# EAGLE schematic control panel (EAGLE 8.4.3)
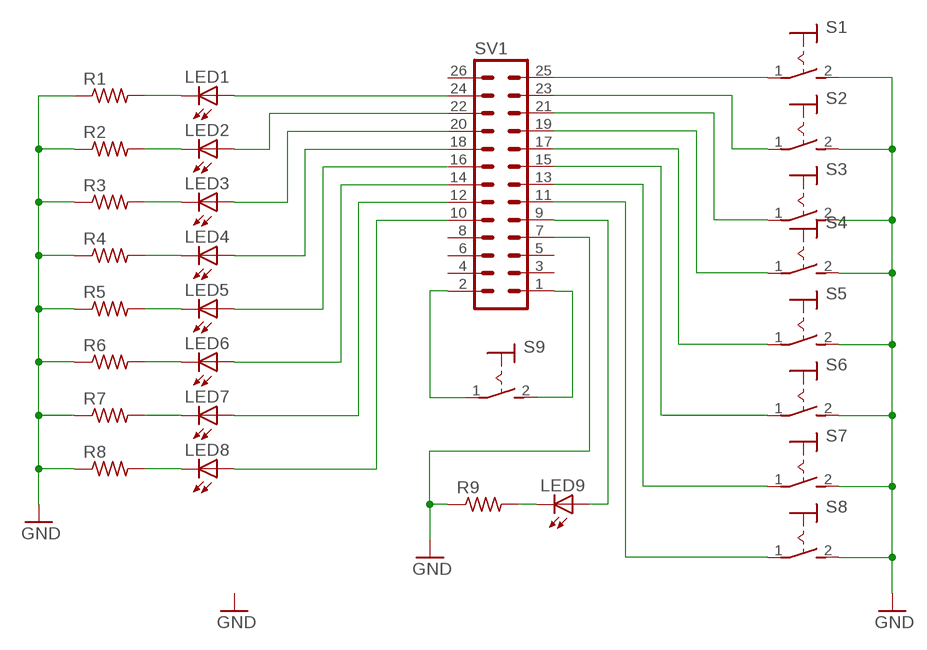
[diagram p0: schematic, sheet 1]

## Parts
LED1  LED3MM  [LED3MM]
LED2  LED3MM  [LED3MM]
LED3  LED3MM  [LED3MM]
LED4  LED3MM  [LED3MM]
LED5  LED3MM  [LED3MM]
LED6  LED3MM  [LED3MM]
LED7  LED3MM  [LED3MM]
LED8  LED3MM  [LED3MM]
LED9  LED3MM  [LED3MM]
R1  R-US_0309/12  [0309/12]
R2  R-US_0309/12  [0309/12]
R3  R-US_0309/12  [0309/12]
R4  R-US_0309/12  [0309/12]
R5  R-US_0309/12  [0309/12]
R6  R-US_0309/12  [0309/12]
R7  R-US_0309/12  [0309/12]
R8  R-US_0309/12  [0309/12]
R9  R-US_0309/12  [0309/12]
S1  MS243  [MS243]
S2  MS243  [MS243]
S3  MS243  [MS243]
S4  MS243  [MS243]
S5  MS243  [MS243]
S6  MS243  [MS243]
S7  MS243  [MS243]
S8  MS243  [MS243]
S9  MS243  [MS243]
SV1  MA13-2  [MA13-2]

## Nets
GND: R1.1 R2.1 R3.1 R4.1 R5.1 R6.1 R7.1 R8.1 R9.1 S1.2(S) S2.2(S) S3.2(S) S4.2(S) S5.2(S) S6.2(S) S7.2(S) S8.2(S) SV1.7
N$1: LED1.A SV1.24
N$2: LED2.A SV1.22
N$3: LED3.A SV1.20
N$4: LED4.A SV1.18
N$5: LED5.A SV1.16
N$6: LED6.A SV1.14
N$7: LED7.A SV1.12
N$8: LED8.A SV1.10
N$9: LED1.K(C) R1.2
N$10: LED2.K(C) R2.2
N$11: LED3.K(C) R3.2
N$12: LED4.K(C) R4.2
N$13: LED5.K(C) R5.2
N$14: LED6.K(C) R6.2
N$15: LED7.K(C) R7.2
N$16: LED8.K(C) R8.2
N$17: S1.1(P) SV1.25
N$18: S2.1(P) SV1.23
N$19: S3.1(P) SV1.21
N$20: S4.1(P) SV1.19
N$21: S5.1(P) SV1.17
N$22: S6.1(P) SV1.15
N$23: S7.1(P) SV1.13
N$24: S8.1(P) SV1.11
N$25: S9.1(P) SV1.2
N$26: S9.2(S) SV1.1
N$27: LED9.A SV1.9
N$28: LED9.K(C) R9.2
Unconnected: SV1.3 SV1.4 SV1.5 SV1.6 SV1.8 SV1.26

## Library data of the parts
LED1-LED9 = adafruit:LED: LED OSRAM: - CHIPLED LG R971, LG N971, LY N971, LG Q971, LY Q971, LO R971, LY R971 LH N974, LH R974 LS Q976, LO Q976, LY Q976 LO Q996 - Hyper CHIPLED LW Q18S LB Q993, LB Q99A, LB R99A - SideLED LS A670, LO A670, LY A670, LG A670, LP A670 LB A673, LV A673, LT A673, LW A673 LH A674 LY A675 LS A676, LA A676, LO A676, LY A676, LW A676 LS A679, LY A679, LG A679 - Hyper Micro SIDELED® LS Y876, LA Y876, LO Y876, LY Y876 LT Y87S - SmartLED LW L88C, LW L88S LB L89C, LB L89S, LG L890 LS L89K, LO L89K, LY L89K LS L896, LA L896, LO L896, LY L896 - TOPLED LS T670, LO T670, LY T670, LG T670, LP T670 LSG T670, LSP T670, LSY T670, LOP T670, LYG T670 LG T671, LOG T671, LSG T671 LB T673, LV T673, LT T673, LW T673 LH T674 LS T676, LA T676, LO T676, LY T676, LB T676, LH T676, LSB T676, LW T676 LB T67C, LV T67C, LT T67C, LS T67K, LO T67K, LY T67K, LW E67C LS E67B, LA E67B, LO E67B, LY E67B, LB E67C, LV E67C, LT E67C LW T67C LS T679, LY T679, LG T679 LS T770, LO T770, LY T770, LG T770, LP T770 LB T773, LV T773, LT T773, LW T773 LH T774 LS E675, LA E675, LY E675, LS T675 LS T776, LA T776, LO T776, LY T776, LB T776 LHGB T686 LT T68C, LB T68C - Hyper Mini TOPLED® LB M676 - Mini TOPLED Santana® LG M470 LS M47K, LO M47K, LY M47K Source: http://www.osram.convergy.de/
R1-R9 = rcl:R-US_: RESISTOR, American symbol
S1-S9 = switch:MS243: TOGGLE SWITCH
SV1 = con-lstb:MA13-2: PIN HEADER; OC_FARNELL: unknown; OC_NEWARK: unknown